# EAGLE design SparkFun_Qwiic_Thermocouple_Amplifier (EAGLE 9.4.1)
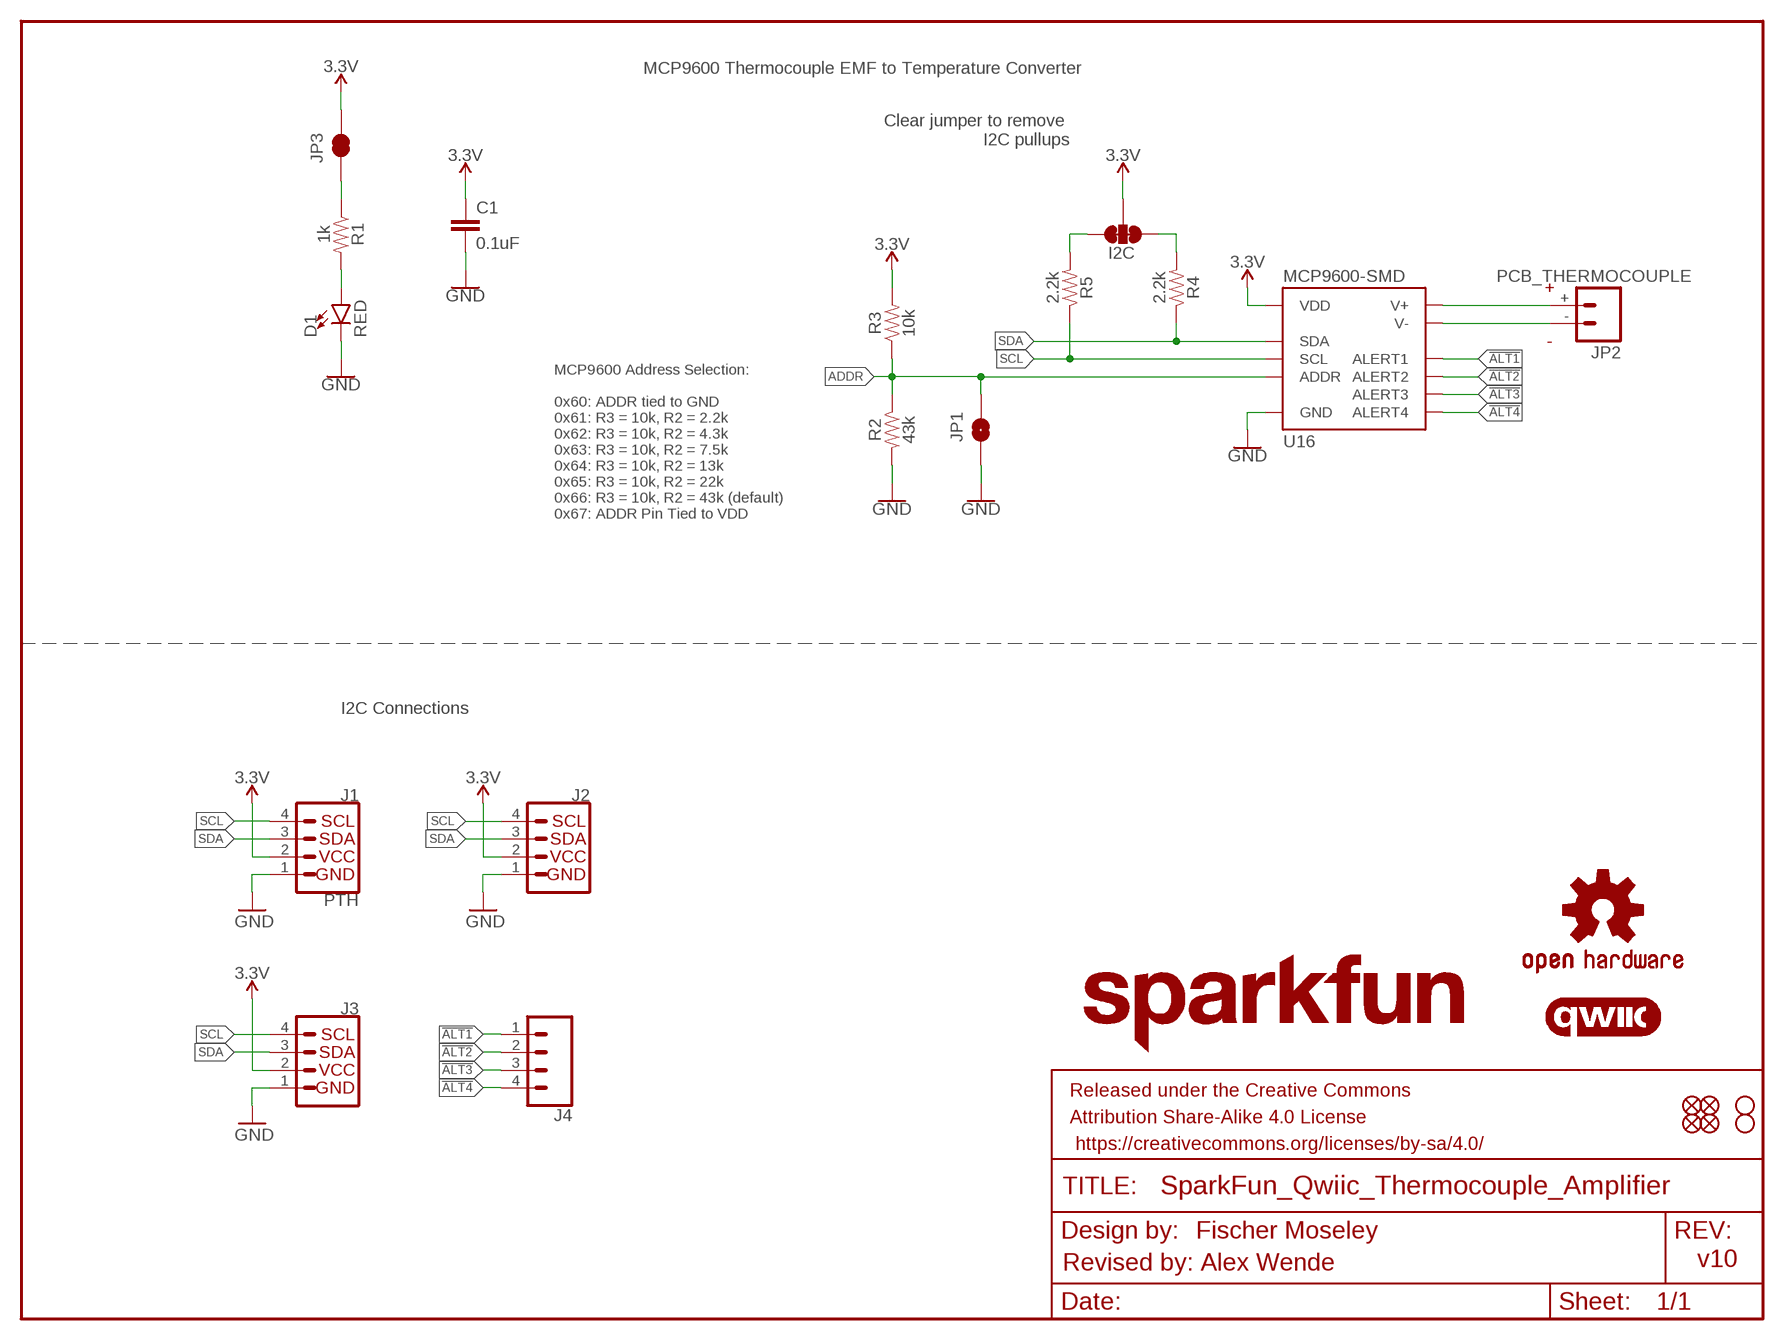
[diagram p0: schematic, sheet 1]

## Parts
C1  0.1uF  0.1UF-0603-25V-(+80/-20%)  [0603]
D1  RED  LED-RED0603  [LED-0603]
FD1  FIDUCIAL1X2  [FIDUCIAL-1X2]
FD2  FIDUCIAL1X2  [FIDUCIAL-1X2]
FD3  FIDUCIAL1X2  [FIDUCIAL-1X2]
FD4  FIDUCIAL1X2  [FIDUCIAL-1X2]
FRAME1  FRAME-LETTER  [CREATIVE_COMMONS]
I2C  JUMPER-SMT_3_2-NC_TRACE_SILK  [SMT-JUMPER_3_2-NC_TRACE_SILK]
J1  PTH  I2C_STANDARD_NO_SILK  [1X04_NO_SILK]
J2  QWIIC_CONNECTORJS-1MM  [JST04_1MM_RA]
J3  QWIIC_CONNECTORJS-1MM  [JST04_1MM_RA]
J4  CONN_041X04_NO_SILK  [1X04_NO_SILK]
JP1  JUMPER-SMT_2_NO_SILK  [SMT-JUMPER_2_NO_SILK]
JP2  PCB_THERMOCOUPLE  [PCC-SMP]
JP3  JUMPER-SMT_2_NC_TRACE_SILK  [SMT-JUMPER_2_NC_TRACE_SILK]
JP8  STAND-OFF  [STAND-OFF]
JP9  STAND-OFF  [STAND-OFF]
LOGO1  OSHW-LOGOMINI  [OSHW-LOGO-MINI]
LOGO2  SFE_LOGO_NAME.1_INCH  [SFE_LOGO_NAME_.1]
LOGO3  QWIIC_LOGO_5MM  [QWIIC_5MM]
R1  1k  1KOHM-0603-1/10W-1%  [0603]
R2  43k  43KOHM-0603-1/10W-1%  [0603]
R3  10k  10KOHM-0603-1/10W-1%  [0603]
R4  2.2k  2.2KOHM-0603-1/10W-1%  [0603]
R5  2.2k  2.2KOHM-0603-1/10W-1%  [0603]
U16  MCP9600-SMD  [MQFN-20]

## Nets
3.3V: C1.1 I2C.2 J1.2(VCC) J2.2 J3.2 JP3.2 R3.2 U16.8(VDD)
!ALT1: J4.1 U16.11(ALERT1)
!ALT2: J4.2 U16.12(ALERT2)
!ALT3: J4.3 U16.14(ALERT3)
!ALT4: J4.4 U16.15(ALERT4)
ADDR: JP1.1 R2.1 R3.1 U16.16(ADDR)
GND: C1.2 D1.C J1.1(GND) J2.1 J3.1 JP1.2 R2.2 U16.1(GND) U16.3(GND) U16.5(GND) U16.6(GND) U16.7(GND) U16.9(GND) U16.10(GND) U16.13(GND) U16.17(GND) U16.18(GND) U16.21(GND)
N$1: D1.A R1.2
N$2: I2C.1 R5.2
N$3: I2C.3 R4.2
N$4: JP2.+ U16.2(V+)
N$5: JP2.- U16.4(V-)
N$6: JP3.1 R1.1
SCL: J1.4(SCL) J2.4 J3.4 R5.1 U16.19(SCL)
SDA: J1.3(SDA) J2.3 J3.3 R4.1 U16.20(SDA)
Unconnected: JP2.CLIP1 JP2.CLIP2

## Notes on the sheet
- MCP9600 Thermocouple EMF to Temperature Converter
- Clear jumper to remove 
  I2C pullups
- MCP9600 Address Selection:
  
  0x60: ADDR tied to GND
  0x61: R3 = 10k, R2 = 2.2k
  0x62: R3 = 10k, R2 = 4.3k 
  0x63: R3 = 10k, R2 = 7.5k
  0x64: R3 = 10k, R2 = 13k 
  0x65: R3 = 10k, R2 = 22k
  0x66: R3 = 10k, R2 = 43k (default)
  0x67: ADDR Pin Tied to VDD
- I2C Connections
- Fischer Moseley
- Revised by: Alex Wende | v10

## Library data of the parts
C1 = SparkFun-Capacitors:0.1UF: 0.1µF ceramic capacitors A capacitor is a passive two-terminal electrical component used to store electrical energy temporarily in an electric field.; PROD_ID: CAP-00810
D1 = SparkFun-LED:LED-RED: Red SMD LED Used in manufacturing of most products at SparkFun Packages: 0603 - SMD 0603 package [Product Link] <http://docs.avagotech.com/docs/AV02-0551EN> 0603 SMART - SMD 0603 SMART package ( more efficient and expensive)[Product Link] <http://www.osram-os.com/Graphics/XPic2/00077099_0.pdf> 1206 - SMD1206 package [Product Link] <https://www.sparkfun.com/datasheets/DevTools/LilyPad/Q150OVS4.pdff> SparkFun Products: Pro Mini 328 -5V <https://www.sparkfun.com/products/821> RedBoard <https://www.sparkfun.com/products/12757> IOIO-OTG <https://www.sparkfun.com/products/13613>; PROD_ID: DIO-00819
FD1-FD4 = SparkFun-Aesthetics:FIDUCIAL: Fiducial Alignment Points Point-of-reference for pick-and-place machines and other optical instruments.
FRAME1 = SparkFun-Aesthetics:FRAME-LETTER: Schematic Frame - Letter Standard 8.5x11 US Letter frame
I2C = SparkFun-Jumpers:JUMPER-SMT_3_2-NC_TRACE: Normally closed trace jumper (2 of 2 connections) This jumper has a trace between all three pads so they are normally closed (NC). Use a razor knife to open the connection(s). For best results follow the IPC guidelines for cutting traces: Cutout at least 0.063 mm (0.005 in). Remove all loose material to clean up the cut area. Seal the cut with an approved epoxy. Reapply solder to reclose the connection(s).
J1 = SparkX:I2C_STANDARD: SparkFun I2C Standard Pinout Header SparkFun has standardized on a pinout for all I2C based sensor breakouts. This pinout allows I2C boards to be plugged directly into the headers on Arduino Uno compatible boards, and to be daisy chained easily. Example SparkFun Products: SparkFun Atmospheric Sensor Breakout - BME280 <https://www.sparkfun.com/products/13676> SparkFun Altitude/Pressure Sensor Breakout - MPL3115A2 <https://www.sparkfun.com/products/11084> SparkFun TOF Range Finder Sensor - VL6180 <https://www.sparkfun.com/products/12785>
J2 J3 = SparkFun-Connectors:QWIIC_CONNECTOR: SparkFun I2C Standard Qwiic Connector An SMD 1mm pitch JST connector makes it easy and quick (get it? Qwiic?) to connect I2C devices to each other. The Qwiic system <http://www.sparkfun.com/qwiic> enables fast and solderless connection between popular platforms and various sensors and actuators. We carry 200mm <https://www.sparkfun.com/products/14204>, 100mm <https://www.sparkfun.com/products/14205>, 50mm <https://www.sparkfun.com/products/14206>, and breadboard friendly <https://www.sparkfun.com/products/14207> Qwiic cables. We also offer 10 pcs strips <https://www.sparkfun.com/products/14323> the SMD connectors.; PROD_ID: CONN-13694
J4 = SparkFun-Connectors:CONN_04: Multi connection point. Often used as Generic Header-pin footprint for 0.1 inch spaced/style header connections On any of the 0.1 inch spaced packages, you can populate with these: Break Away Headers - Straight <https://www.sparkfun.com/products/116> (PRT-00116) Break Away Male Headers - Right Angle <https://www.sparkfun.com/products/553> (PRT-00553) Female Headers <https://www.sparkfun.com/products/115> (PRT-00115) Break Away Headers - Machine Pin <https://www.sparkfun.com/products/117> (PRT-00117) Break Away Female Headers - Swiss Machine Pin <https://www.sparkfun.com/products/743> (PRT-00743) For SCREWTERMINALS and SPRING TERMINALS visit here: Screw Terimnals on SparkFun.com <https://www.sparkfun.com/search/results?term=Screw+Terminals> (5mm/3.5mm/2.54mm spacing) This device is also useful as a general connection point to wire up your design to another part of your project. Our various solder wires solder well into these plated through hole pads. Hook-Up Wire - Assortment (Stranded, 22 AWG) <https://www.sparkfun.com/products/11375> (PRT-11375) Hook-Up Wire - Assortment (Solid Core, 22 AWG) <https://www.sparkfun.com/products/11367> (PRT-11367) View the entire wire category on our website here <https://www.sparkfun.com/categories/141> Special notes: Molex polarized connector foot print use with SKU : PRT-08231 with associated crimp pins and housings. 1MM SMD Version SKU: PRT-10208; PROD_ID: CONN-09696
JP1 = SparkFun-Jumpers:JUMPER-SMT_2_NO: Normally open jumper This jumper has two pads in close proximity to each other. Apply solder to close the connection. Round pads are easier to solder for beginners, but are a lot larger. SparkFun Product that uses the round pads: SparkFun EL Sequencer <https://www.sparkfun.com/products/12781>
JP2 = MCP9600:PCB_THERMOCOUPLE: Circuit Board Thermocouple Connectors Glass-Filled Nylon 220°C (425°F) The PCC connector from OMEGA is perfect for bringing thermocouple probes to printed circuit boards. (OMEGA PCC-SMP) For type-k thermocouples.
JP3 = SparkFun-Jumpers:JUMPER-SMT_2_NC_TRACE: Normally closed trace jumper This jumper has a trace between two pads so it's normally closed (NC). Use a razor knife to open the connection. For best results follow the IPC guidelines for cutting traces: Cutout at least 0.063 mm (0.005 in). Remove all loose material to clean up the cut area. Seal the cut with an approved epoxy. Reapply solder to reclose the connection.
JP8 JP9 = SparkFun:STAND-OFF: Stand Off This is the mechanical footprint for a #4 phillips button head screw. Use the keepout ring to avoid running the screw head into surrounding components. SKU : PRT-00447
LOGO1 = SparkFun-Aesthetics:OSHW-LOGO: Open-Source Hardware (OSHW) Logo This logo indicates the piece of hardware it is found on incorporates a OSHW license and/or adheres to the definition of open source hardware found here: http://freedomdefined.org/OSHW
LOGO2 = SparkFun-Aesthetics:SFE_LOGO_NAME: SparkFun Font Logo This is the SparkFun name logo. The logo on the schematic will always be the same size; the package variant is the height of the flame part of the logo (or the height the flame would be, if it were drawn). Default layer for the logo on the board is tSilk.
LOGO3 = SparkFun-Aesthetics:QWIIC_LOGO: Qwiic Logos for placement on schematic and PCB. The 5.5mm silk logo is best for placing next to Qwiic connector.
R1 = SparkFun-Resistors:1KOHM: 1kΩ resistor A resistor is a passive two-terminal electrical component that implements electrical resistance as a circuit element. Resistors act to reduce current flow, and, at the same time, act to lower voltage levels within circuits. - Wikipedia; PROD_ID: RES-07856
R2 = SparkFun-Resistors:43KOHM: 43kΩ resistor A resistor is a passive two-terminal electrical component that implements electrical resistance as a circuit element. Resistors act to reduce current flow, and, at the same time, act to lower voltage levels within circuits. - Wikipedia; PROD_ID: RES-07858
R3 = SparkFun-Resistors:10KOHM: 10kΩ resistor A resistor is a passive two-terminal electrical component that implements electrical resistance as a circuit element. Resistors act to reduce current flow, and, at the same time, act to lower voltage levels within circuits. - Wikipedia; PROD_ID: RES-00824
R4 R5 = SparkFun-Resistors:2.2KOHM: 2.2kΩ resistor A resistor is a passive two-terminal electrical component that implements electrical resistance as a circuit element. Resistors act to reduce current flow, and, at the same time, act to lower voltage levels within circuits. - Wikipedia; PROD_ID: RES-08272
U16 = MCP9600:MCP9600: Thermocouple EMF to Temperature Converter

## Board
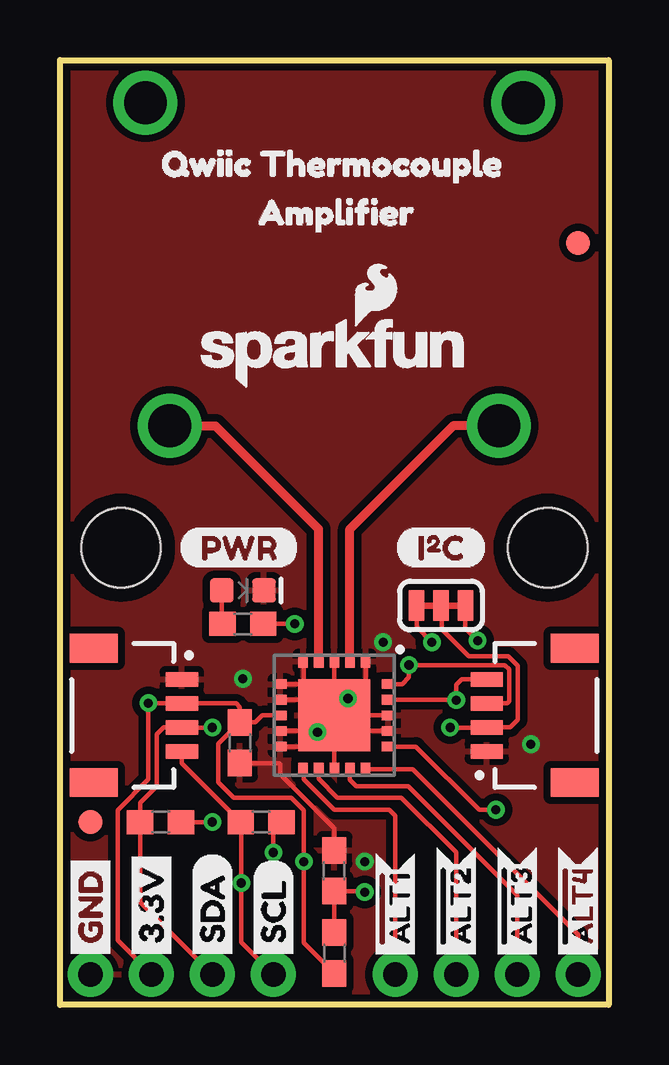
[diagram p1: board, top side]
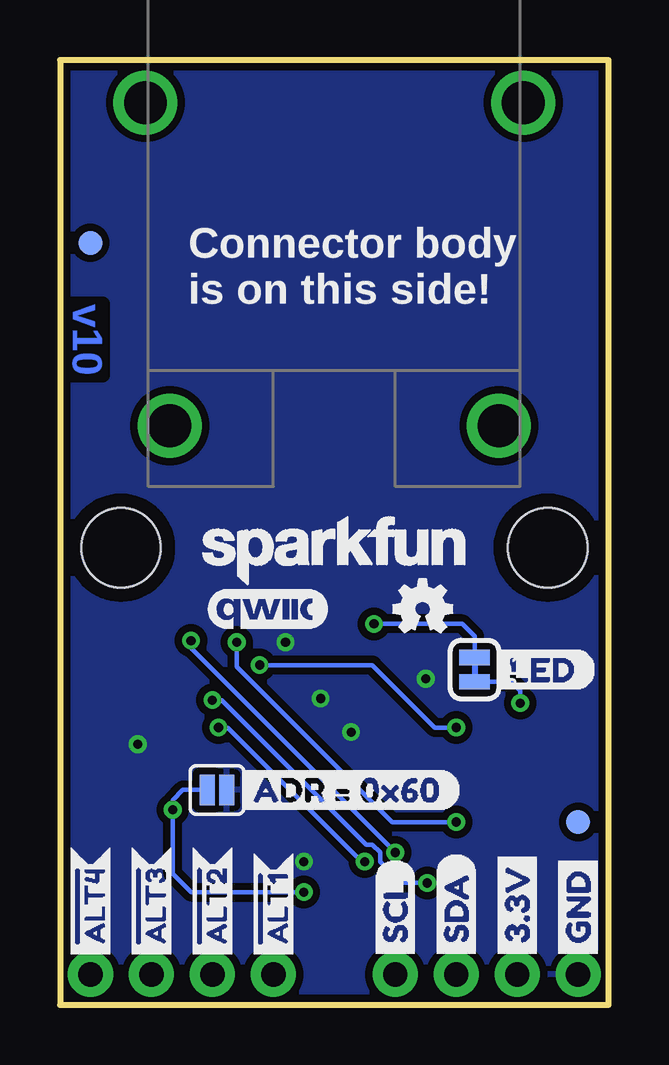
[diagram p2: board, bottom side, seen from below]

Size 22.86 x 39.37 mm. Coordinates in mm from the lower left corner, seen from the top.
Outline: 0,0 0,39.37 22.86,39.37 22.86,0 0,0
Copper layers (1*16): Top 0.035mm / dielectric 1.5mm / Bottom 0.035mm
Design rules "SparkFun-2-layer-TIGHT": minimum track width 7mil, minimum drill 15mil, track to track 7mil, track to pad 7mil, pad to pad 7mil, via to via 7mil, smd to smd 7mil, copper to edge 7mil, drill to drill 7mil, minimum pad ring 7mil, minimum via ring 7mil, stop-mask expansion 4mil, vias tented up to drill 25mil, thermal gap 10mil
tRestrict: 3 lines

### Footprints (pad centres in the part's own frame; a part is rotated, then mirrored left to right if it is on the bottom)
0603 = smd 1.1 x 1: 1 -0.85,0; 2 0.85,0
LED-0603 = smd 1 x 1: A -0.877,0; C 0.877,0
FIDUCIAL-1X2 = smd 1 x 1: 1 0,0
SMT-JUMPER_3_2-NC_TRACE_SILK = smd 0.635 x 1.27: 1 -1.016,0; 2 0,0; 3 1.016,0
1X04_NO_SILK = drill 1.016 pad 1.88: 1 0,0; 2 2.54,0; 3 5.08,0; 4 7.62,0
JST04_1MM_RA = smd 0.6 x 1.35: 1 -1.5,0; 2 -0.5,0; 3 0.5,0; 4 1.5,0 | smd 1.2 x 2: NC1 2.8,-3.675; NC2 -2.8,-3.675
SMT-JUMPER_2_NO_SILK = smd 0.635 x 1.27: 1 -0.406,0; 2 0.406,0
PCC-SMP = drill 1.778: + 6.858,0; - -6.858,0; CLIP1 -7.874,-13.462; CLIP2 7.874,-13.462
SMT-JUMPER_2_NC_TRACE_SILK = smd 0.635 x 1.27: 1 -0.508,0; 2 0.508,0
STAND-OFF = hole 3.302: 0,0
MQFN-20 = smd 0.55 x 0.4: 1 -2.25,1.3; 2 -2.25,0.65; 3 -2.25,0; 4 -2.25,-0.65; 5 -2.25,-1.3; 11 2.25,-1.3; 12 2.25,-0.65; 13 2.25,0; 14 2.25,0.65; 15 2.25,1.3 | smd 0.4 x 0.55: 6 -1.3,-2.25; 7 -0.65,-2.25; 8 0,-2.25; 9 0.65,-2.25; 10 1.3,-2.25; 16 1.3,2.25; 17 0.65,2.25; 18 0,2.25; 19 -0.65,2.25; 20 -1.3,2.25 | smd 3 x 3: 21 0,0

### Placement (x,y rotation side)
C1  7.49,10.92 270 top
D1  7.62,17.27 0 top
FD1  1.27,7.62 0 top
FD2  21.59,31.75 0 top
FD3  21.59,31.75 0 bottom
FD4  1.27,7.62 0 bottom
FRAME1  -13.97,-19.05 0 top  (outside the outline)
I2C  15.88,16.64 180 top
J1  1.27,1.27 0 top
J2  17.78,12.06 90 top
J3  5.08,12.06 270 top
J4  13.97,1.27 0 top
JP1  16.32,8.95 0 bottom
JP2  11.43,24.13 180 bottom
JP3  5.59,13.97 270 bottom
JP8  20.32,19.05 0 top
JP9  2.54,19.05 0 top
LOGO1  7.75,16.51 0 bottom
LOGO2  11.43,18.92 0 bottom
LOGO3  14.22,16.51 0 bottom
R1  7.62,15.88 180 top
R2  11.43,5.59 90 top
R3  11.43,2.16 270 top
R4  4.19,7.62 0 top
R5  8.38,7.62 0 top
U16  11.43,12.06 270 top
U$1  [#ALT30]  19.05,1.46 90 top
U$2  [ADR_#_0X600]  15.75,8.95 0 bottom
U$3  [#ALT10]  13.97,1.46 90 bottom
U$4  [#ALT20]  16.51,1.46 90 bottom
U$5  [#ALT30]  19.05,1.46 90 bottom
U$6  [QWIIC_THERMOCOUPLE2]  3.3,35.05 0 top
U$7  [#ALT40]  21.59,1.46 90 bottom
U$8  [#ALT10]  13.97,1.46 90 top
U$9  [SCL-[)]  8.89,1.65 90 bottom
U$10  [GND-04]  1.27,1.65 90 top
U$11  [#ALT40]  21.59,1.46 90 top
U$12  [SCL-[)]  8.89,1.65 90 top
U$13  [SDA-[)]  6.35,1.65 90 top
U$14  [SDA-[)]  6.35,1.65 90 bottom
U$16  [LED1]  5.08,13.97 0 bottom
U$17  [SFE_LOGO_NAME_FLAME_.1]  11.43,27.18 0 top
U$18  [#ALT20]  16.51,1.46 90 top
U$19  [3.3V]  3.81,1.65 90 top
U$20  [PWR-()-04]  4.95,19.05 0 top
U$21  [I_SUPER2_C-()-04]  13.97,19.05 0 top
U$22  [3.3V]  3.81,1.65 90 bottom
U$23  [GND-04]  1.27,1.65 90 bottom
U$25  [AMPLIFIER2]  7.37,33.02 0 top

### Tracks (layer width: path | path; a pad name or v marks a point on that pad's centre or on a via)
3.3V  (via drill 0.38)
  Top 0.178: U16.8 8.42,12.06 8.13,11.77 C1.1 | C1.1 7.49,12.41 7.33,12.56 J3.2 3.69,12.56 v3.68,12.57 3.68,9.4 2.4,8.11 2.4,2.68 J1.2 | C1.1 6.6,10.88 6.6,9.27 7.24,8.64 9.64,8.64 10.16,8.12 v10.16,5.97 10.16,2.58 R3.2 | I2C.2 15.91,16.6 15.91,15.65 17.04,14.53 18.67,14.53 19.08,14.12 19.08,11.88 18.77,11.56 J2.2 v16.26,11.56
  Bottom 0.178: v16.26,11.56 15.88,11.56 10.29,5.97 v10.16,5.97 | JP3.2 4.06,13.46 3.68,13.08 v3.68,12.57
!ALT1
  Top 0.178: U16.11 10.16,9.79 10.16,9.4 11.43,8.13 13.72,8.13 13.97,7.87 J4.1
!ALT2
  Top 0.178: U16.12 10.78,9.41 11.56,8.64 14.22,8.64 16.51,6.35 J4.2
!ALT3
  Top 0.178: U16.14 12.08,9.38 12.34,9.12 14.5,9.12 19.05,4.57 J4.3
!ALT4
  Top 0.178: U16.15 14.7,9.81 15.6,8.91 17.58,6.93 21.59,2.92 J4.4
ADDR  (via drill 0.38)
  Top 0.178: R3.1 R2.1 12.66,4.74 v12.7,4.7 | v18.16,8.13 17.46,8.13 14.82,10.77 U16.16
  Bottom 0.178: v12.7,4.7 17.4,4.7 18.16,5.46 v18.16,8.13 18.16,8.53 17.74,8.95 JP1.1
GND  (via drill 0.38)
  Top 0.178: U16.1 12.73,12.73 | 11.43,11.43 11.45,11.41 | 10.16,12.7 10.14,12.71 U16.7 | R2.2 11.43,7.37 9.18,9.62 9.18,10.03 9.14,10.07 C1.2 | U16.3 11.43,12.7 | U16.5 10.16,14.29 10.16,13.34 | 10.16,13.34 10.16,12.7 | U16.10 10.77,10.77 11.43,11.43 | U16.13 11.43,11.4 | U16.17 11.45,11.41 | 11.45,11.41 11.43,11.4 | 10.16,12.7 11.43,11.43 | U16.6 10.13,13.37 10.16,13.34 | U16.18 U16.21 11.43,11.43 | 11.43,11.43 11.43,11.4 | U16.9 11.45,11.41
  other vias: 12.7,5.97 19.62,10.86 7.62,13.59 13.46,15.11 12,12.76 10.73,11.37
  pour Bottom (isolate 0.305): 22.86,0 22.86,39.37 0,39.37 0,0
  pour Top (isolate 0.305): 0,0 0,39.37 22.86,39.37 22.86,0
N$1
  Top 0.178: D1.A 6.74,15.9 R1.2
N$2  (via drill 0.38)
  Top 0.178: R5.2 8.89,7.28 v8.89,6.35 | v17.4,15.18 16.89,15.68 I2C.1
  Bottom 0.178: v17.4,15.18 17.4,14.86 v8.89,6.35
N$3  (via drill 0.38)
  Top 0.178: v15.49,15.11 14.86,15.75 I2C.3 | v6.35,7.62 R4.2
  Bottom 0.178: v15.49,15.11 15.49,14.1 9.02,7.62 v6.35,7.62
N$4
  Top 0.381: U16.2 12.08,19.83 16.38,24.13 JP2.+
N$5
  Top 0.381: U16.4 10.78,19.83 6.48,24.13 JP2.-
N$6  (via drill 0.38)
  Top 0.178: R1.1 v9.78,15.88
  Bottom 0.178: JP3.1 5.59,15.37 6.1,15.88 v9.78,15.88
SCL  (via drill 0.38)
  Top 0.178: J2.4 16.74,13.56 16.51,13.34 v16.51,12.7 16.5,12.71 U16.19 | J1.4 7.56,2.6 v7.56,5.08 7.56,7.6 R5.1 5.08,10.07 J3.4
  Bottom 0.178: v16.51,12.7 16.13,12.7 10.1,6.67 9.84,6.67 9.53,6.35 9.53,5.97 8.64,5.08 v7.56,5.08
SDA  (via drill 0.38)
  Top 0.178: J1.3 3.34,4.28 R4.1 3.34,8.42 4.04,9.12 4.04,11.28 4.32,11.56 J3.3 v6.35,11.56 | J2.3 18.64,12.56 18.72,12.65 18.72,13.97 18.54,14.16 v14.54,14.16 14.54,13.65 14.25,13.37 U16.20
  Bottom 0.178: v6.35,11.56 7.24,11.56 9.84,14.16 v14.54,14.16

### Text on the board
Bottom: v10
bPlace: Connector body / is on this side!
tDocu: Fischer Moseley | Revised by: Alex Wende